# EAGLE design Arduino Neptune (EAGLE 9.4.1)
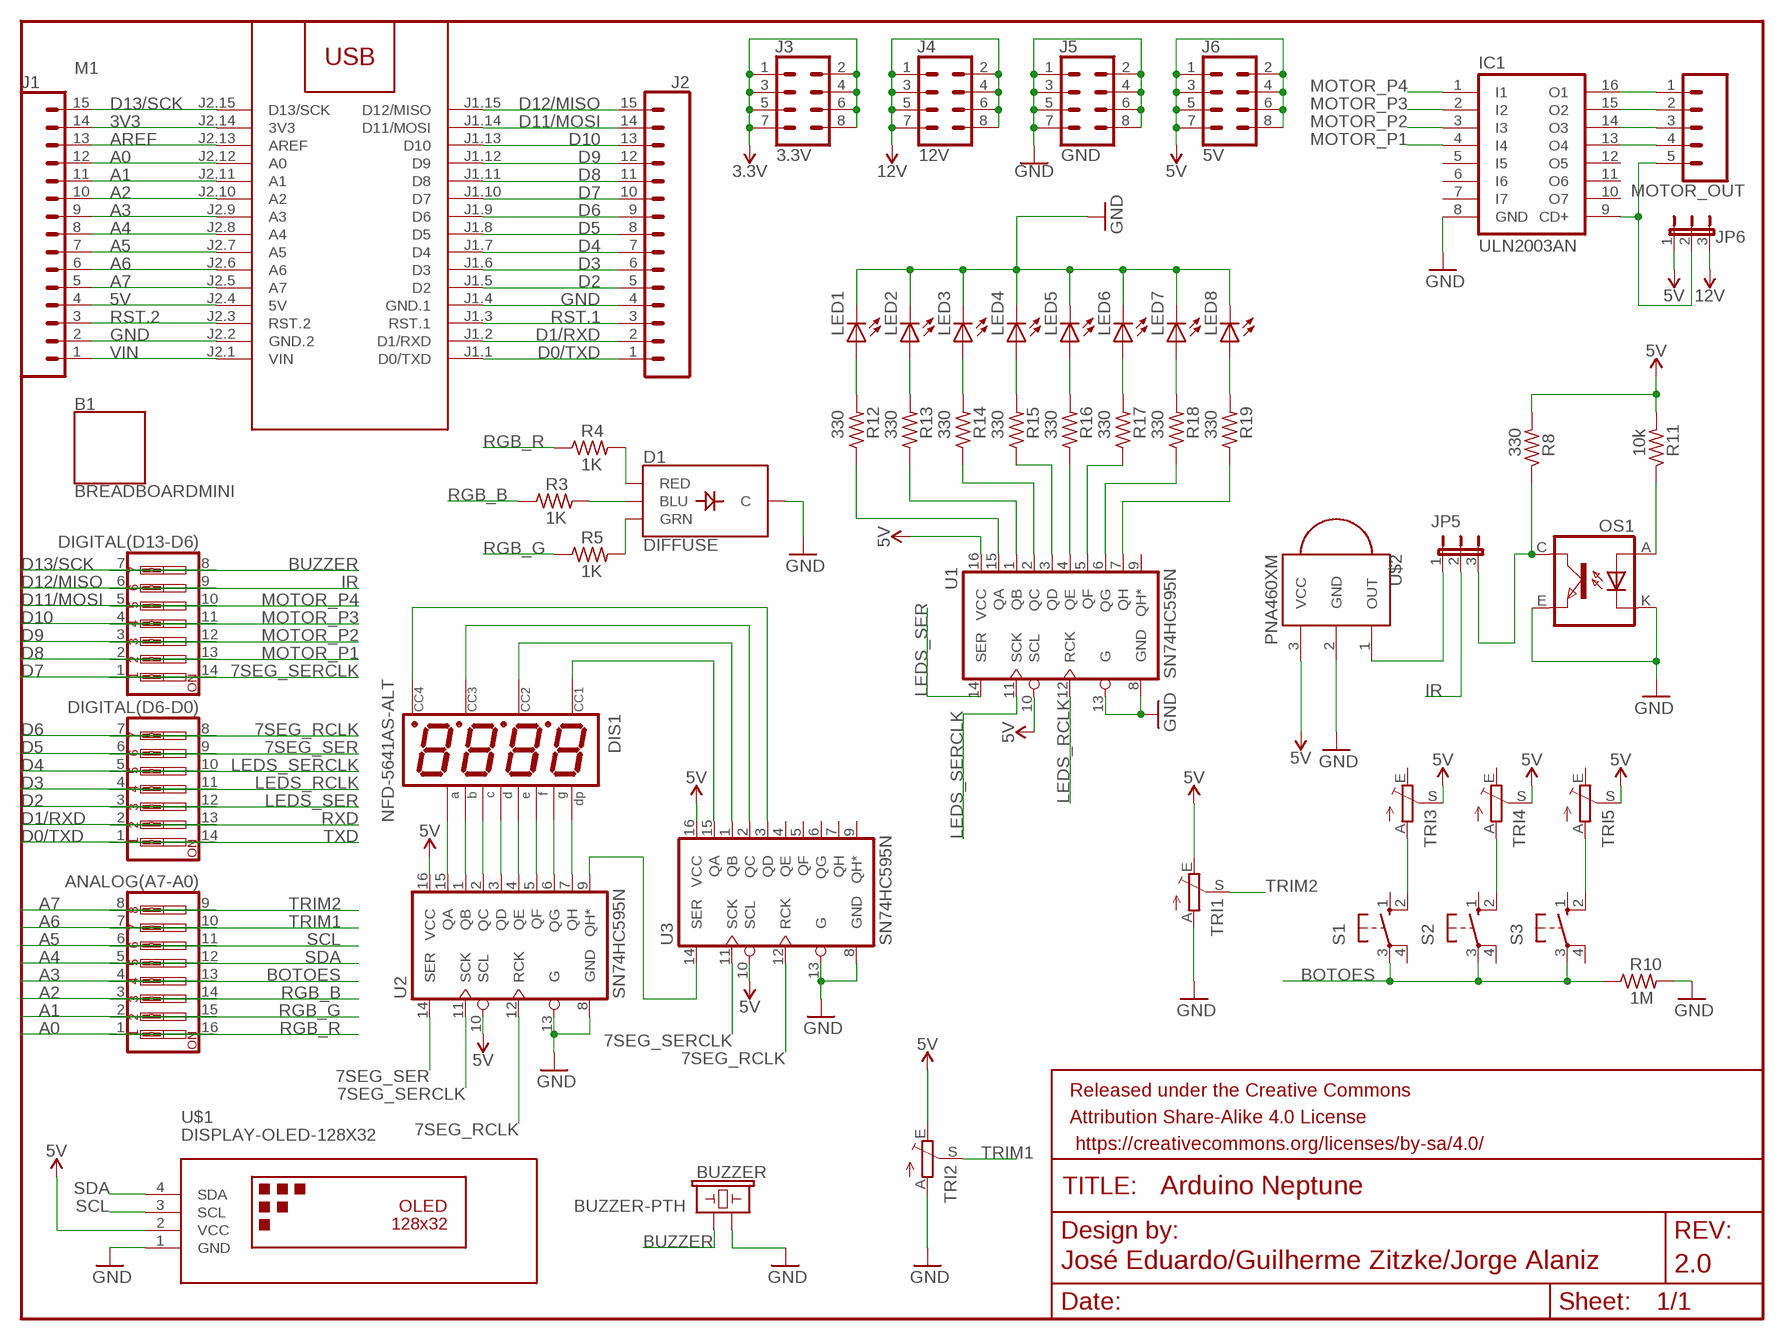
[diagram p0: schematic, sheet 1]

## Parts
ANALOG(A7-A0)  SW_DIP-8  [EDG-08]
B1  BREADBOARDMINI  [BREADBOARD-MINI]
BUZZER  BUZZER-PTH  [BUZZER-12MM]
D1  DIFFUSE  LED-RGB-CCDIFFUSE  [LED-RGB-THRU]
DIGITAL(D6-D0)  SW_DIP-7  [EDG-07]
DIGITAL(D13-D6)  SW_DIP-7  [EDG-07]
DIS1  NFD-5641AS-ALT  [NFD-5641]
FRAME2  FRAME-LETTER  [CREATIVE_COMMONS]
IC1  ULN2003AN  [DIL16]
J1  CONN_15LOCK_LONGPADS  [1X15_LOCK_LONGPADS]
J2  CONN_15LOCK_LONGPADS  [1X15_LOCK_LONGPADS]
J3  3.3V  CONN_04X2  [2X4]
J4  12V  CONN_04X2  [2X4]
J5  GND  CONN_04X2  [2X4]
J6  5V  CONN_04X2  [2X4]
JP5  JP2E  [JP2]
JP6  JP2E  [JP2]
LED1  LED5MM  [LED5MM]
LED2  LED5MM  [LED5MM]
LED3  LED5MM  [LED5MM]
LED4  LED5MM  [LED5MM]
LED5  LED5MM  [LED5MM]
LED6  LED5MM  [LED5MM]
LED7  LED5MM  [LED5MM]
LED8  LED5MM  [LED5MM]
M1  ARDUINO-NANO-3.0  [ARDUINO-NANO-3.0]
MOTOR_OUT  CONN_05JST-VERT  [JST-5-PTH-VERT]
OS1  TCRT5000  [TCRT5000]
R3  1K  R-US_0204/7  [0204/7]
R4  1K  R-US_0204/7  [0204/7]
R5  1K  R-US_0204/7  [0204/7]
R8  330  R-US_0204/7  [0204/7]
R10  1M  R-US_0204/7  [0204/7]
R11  10k  R-US_0204/7  [0204/7]
R12  330  R-US_0204/7  [0204/7]
R13  330  R-US_0204/7  [0204/7]
R14  330  R-US_0204/7  [0204/7]
R15  330  R-US_0204/7  [0204/7]
R16  330  R-US_0204/7  [0204/7]
R17  330  R-US_0204/7  [0204/7]
R18  330  R-US_0204/7  [0204/7]
R19  330  R-US_0204/7  [0204/7]
S1  40-XX  [B3F-40XX]
S2  40-XX  [B3F-40XX]
S3  40-XX  [B3F-40XX]
TRI1  TRIM_EU-B64Y  [B64Y]
TRI2  TRIM_EU-B64Y  [B64Y]
TRI3  TRIM_EU-B64Y  [B64Y]
TRI4  TRIM_EU-B64Y  [B64Y]
TRI5  TRIM_EU-B64Y  [B64Y]
U1  SN74HC595N  74HC595N  [DIP16]
U2  SN74HC595N  74HC595N  [DIP16]
U3  SN74HC595N  74HC595N  [DIP16]
U$1  DISPLAY-OLED-128X32  [DISPLAY-OLED-128X32]
U$2  PNA460XM  [PNA460XM]

## Nets
3.3V: J3.1 J3.2 J3.3 J3.4 J3.5 J3.6 J3.7 J3.8
3V3: J1.14 M1.J2.14(3V3)
5V: J1.4 J6.1 J6.2 J6.3 J6.4 J6.5 J6.6 J6.7 J6.8 JP6.1 M1.J2.4(5V) R8.2 R11.2 TRI1.E TRI2.E TRI3.S TRI4.S TRI5.S U1.10(SCL) U1.16(VCC) U2.10(SCL) U2.16(VCC) U3.10(SCL) U3.16(VCC) U$1.2(VCC) U$2.3(VCC)
7SEG_RCLK: DIGITAL(D6-D0).7 U2.12(RCK) U3.12(RCK)
7SEG_SER: DIGITAL(D6-D0).6 U2.14(SER)
7SEG_SERCLK: DIGITAL(D13-D6).1 U2.11(SCK) U3.11(SCK)
12V: J4.1 J4.2 J4.3 J4.4 J4.5 J4.6 J4.7 J4.8 JP6.3
A0: ANALOG(A7-A0).16 J1.12 M1.J2.12(A0)
A1: ANALOG(A7-A0).15 J1.11 M1.J2.11(A1)
A2: ANALOG(A7-A0).14 J1.10 M1.J2.10(A2)
A3: ANALOG(A7-A0).13 J1.9 M1.J2.9(A3)
A4: ANALOG(A7-A0).12 J1.8 M1.J2.8(A4)
A5: ANALOG(A7-A0).11 J1.7 M1.J2.7(A5)
A6: ANALOG(A7-A0).10 J1.6 M1.J2.6(A6)
A7: ANALOG(A7-A0).9 J1.5 M1.J2.5(A7)
AREF: J1.13 M1.J2.13(AREF)
BOTOES: ANALOG(A7-A0).4 R10.1 S1.3(P) S2.3(P) S3.3(P)
BUZZER: BUZZER.+ DIGITAL(D13-D6).7
D0/TXD: DIGITAL(D6-D0).14 J2.1 M1.J1.1(D0/TXD)
D1/RXD: DIGITAL(D6-D0).13 J2.2 M1.J1.2(D1/RXD)
D2: DIGITAL(D6-D0).12 J2.5 M1.J1.5(D2)
D3: DIGITAL(D6-D0).11 J2.6 M1.J1.6(D3)
D4: DIGITAL(D6-D0).10 J2.7 M1.J1.7(D4)
D5: DIGITAL(D6-D0).9 J2.8 M1.J1.8(D5)
D6: DIGITAL(D6-D0).8 J2.9 M1.J1.9(D6)
D7: DIGITAL(D13-D6).14 J2.10 M1.J1.10(D7)
D8: DIGITAL(D13-D6).13 J2.11 M1.J1.11(D8)
D9: DIGITAL(D13-D6).12 J2.12 M1.J1.12(D9)
D10: DIGITAL(D13-D6).11 J2.13 M1.J1.13(D10)
D11/MOSI: DIGITAL(D13-D6).10 J2.14 M1.J1.14(D11/MOSI)
D12/MISO: DIGITAL(D13-D6).9 J2.15 M1.J1.15(D12/MISO)
D13/SCK: DIGITAL(D13-D6).8 J1.15 M1.J2.15(D13/SCK)
GND: BUZZER.- D1.2(C) IC1.8(GND) J1.2 J2.4 J5.1 J5.2 J5.3 J5.4 J5.5 J5.6 J5.7 J5.8 LED1.K(C) LED2.K(C) LED3.K(C) LED4.K(C) LED5.K(C) LED6.K(C) LED7.K(C) LED8.K(C) M1.J1.4(GND.1) M1.J2.2(GND.2) OS1.E(EMITTER) OS1.K(CATHODE) R10.2 TRI1.A TRI2.A U1.8(GND) U1.13(G) U2.8(GND) U2.13(G) U3.8(GND) U3.13(G) U$1.1(GND) U$2.2(GND)
IR: DIGITAL(D13-D6).6 JP5.2
LEDS_RCLK: DIGITAL(D6-D0).4 U1.12(RCK)
LEDS_SER: DIGITAL(D6-D0).3 U1.14(SER)
LEDS_SERCLK: DIGITAL(D6-D0).5 U1.11(SCK)
MOTOR_P1: DIGITAL(D13-D6).2 IC1.4(I4)
MOTOR_P2: DIGITAL(D13-D6).3 IC1.3(I3)
MOTOR_P3: DIGITAL(D13-D6).4 IC1.2(I2)
MOTOR_P4: DIGITAL(D13-D6).5 IC1.1(I1)
N$1: D1.3(GRN) R5.2
N$2: D1.4(BLU) R3.2
N$3: D1.1(RED) R4.2
N$4: IC1.16(O1) MOTOR_OUT.1
N$5: IC1.9(CD+) JP6.2 MOTOR_OUT.5
N$6: LED8.A R19.2
N$7: LED7.A R18.2
N$8: LED6.A R17.2
N$9: R16.1 U1.4(QE)
N$10: LED5.A R16.2
N$11: LED4.A R15.2
N$12: LED3.A R14.2
N$13: LED2.A R13.2
N$14: LED1.A R12.2
N$15: JP5.1 U$2.1(OUT)
N$17: OS1.A(ANODE) R11.1
N$18: JP5.3 OS1.C(COLLECTOR) R8.1
N$66: IC1.15(O2) MOTOR_OUT.2
N$67: IC1.14(O3) MOTOR_OUT.3
N$68: IC1.13(O4) MOTOR_OUT.4
N$70: DIS1.P$11 U2.15(QA)
N$71: DIS1.P$7 U2.1(QB)
N$72: DIS1.P$4 U2.2(QC)
N$73: DIS1.P$2 U2.3(QD)
N$74: DIS1.P$1 U2.4(QE)
N$75: DIS1.P$10 U2.5(QF)
N$76: DIS1.P$5 U2.6(QG)
N$77: DIS1.P$3 U2.7(QH)
N$78: U2.9(QH*) U3.14(SER)
N$79: DIS1.P$8 U3.2(QC)
N$80: DIS1.P$9 U3.1(QB)
N$81: DIS1.P$12 U3.15(QA)
N$82: DIS1.P$6 U3.3(QD)
N$92: R12.1 U1.15(QA)
N$93: R13.1 U1.1(QB)
N$94: R14.1 U1.2(QC)
N$95: R15.1 U1.3(QD)
N$97: R17.1 U1.5(QF)
N$98: R18.1 U1.6(QG)
N$99: S1.2(S1) TRI3.A
N$102: R19.1 U1.7(QH)
N$103: S2.2(S1) TRI4.A
N$104: S3.2(S1) TRI5.A
RGB_B: ANALOG(A7-A0).3 R3.1
RGB_G: ANALOG(A7-A0).2 R5.1
RGB_R: ANALOG(A7-A0).1 R4.1
RST.1: J2.3 M1.J1.3(RST.1)
RST.2: J1.3 M1.J2.3(RST.2)
RXD: DIGITAL(D6-D0).2
SCL: ANALOG(A7-A0).6 U$1.3(SCL)
SDA: ANALOG(A7-A0).5 U$1.4(SDA)
TRIM1: ANALOG(A7-A0).7 TRI2.S
TRIM2: ANALOG(A7-A0).8 TRI1.S
TXD: DIGITAL(D6-D0).1
VIN: J1.1 M1.J2.1(VIN)
Unconnected: IC1.5(I5) IC1.6(I6) IC1.7(I7) IC1.10(O7) IC1.11(O6) IC1.12(O5) S1.1(S) S1.4(P1) S2.1(S) S2.4(P1) S3.1(S) S3.4(P1) TRI3.E TRI4.E TRI5.E U1.9(QH*) U3.4(QE) U3.5(QF) U3.6(QG) U3.7(QH) U3.9(QH*)

## Library data of the parts
ANALOG(A7-A0) = special:SW_DIP-8: DIP SWITCH
B1 = SparkFun-Boards:BREADBOARD: SparkFun Breadboard Mini This is the mechnical outline for the very small self adhesive breadboard from SparkFun Electronics and our prototyping breadboard of the same size. Good for very small proto areas. SparkFun Products: White <https://www.sparkfun.com/products/7916> Green <https://www.sparkfun.com/products/12046> Black <https://www.sparkfun.com/products/12047> Red <https://www.sparkfun.com/products/12044> Blue <https://www.sparkfun.com/products/12045> SparkFun Solder-able Breadboard-Mini <https://www.sparkfun.com/products/12702>; PROD_ID: COMP-12034
BUZZER = SparkFun-Electromechanical:BUZZER: Buzzer Small round buzzers that operate around the audible 2kHz range. You can use these as speakers to create simple music or user interfaces. Variant Overview: PTH - Mini Speaker - PC Mount 12mm 2.048kHz <https://www.sparkfun.com/products/7950> PTH_KIT - Mini Speaker - PC Mount 12mm 2.048kHz <https://www.sparkfun.com/products/7950> KIT simplifies soldering by adding stop mask to one side of the pads. PTH_NO_SILK - Mini Speaker - PC Mount 12mm 2.048kHz <https://www.sparkfun.com/products/7950> No silkscreen indicator of buzzer outline. PTH_KIT_NO_SILK - Mini Speaker - PC Mount 12mm 2.048kHz <https://www.sparkfun.com/products/7950> KIT package w/o silkscreen SMD - Buzzer Audio Magnetic (CCV-084B16) SMD buzzer used on, e.g. the LilyPad Buzzer <https://www.sparkfun.com/products/8463> and RFID USB Reader <https://www.sparkfun.com/products/9963>. SMD_KIT - Buzzer Audio Magnetic (CCV-084B16) SMD Buzzer with elongated pins to make soldering easier. Used on the SparkFun Simon Says - Surface Mount Soldering Kit <https://www.sparkfun.com/products/10935>.; PROD_ID: COMP-08253; SF_SKU: COM-07950
D1 = SparkFun-LED:LED-RGB-CC: LED-RGB Common Cathode Packages: LED RGB-THRU LED_PIRANHA_5MM SparkFun Products: RGB Diffused Common Cathode- Diffuse <[https://www.sparkfun.com/products/9264]> RGB Diffused Common Cathode - Clear <[https://www.sparkfun.com/products/105]> LED-RGB 5mm Square (Piranha) <[https://www.sparkfun.com/products/11679]>; PROD_ID: DIO-09434
DIGITAL(D6-D0) DIGITAL(D13-D6) = special:SW_DIP-7: DIP SWITCH
DIS1 = display-nfd:NFD-5641AS-ALT: Four Digit 0.56" CC Seven-Segment LED Display Futurlec part number: 7FR5641AS Created by RobG
FRAME2 = SparkFun-Aesthetics:FRAME-LETTER: Schematic Frame - Letter Standard 8.5x11 US Letter frame; DESIGNER: José Eduardo/Guilherme Zitzke/Jorge Alaniz; REV: 2.0
IC1 = uln-udn:ULN2003A: DRIVER ARRAY
J1 J2 = SparkFun-Connectors:CONN_15: Multi connection point. Often used as Generic Header-pin footprint for 0.1 inch spaced/style header connections On any of the 0.1 inch spaced packages, you can populate with these: Break Away Headers - Straight <https://www.sparkfun.com/products/116> (PRT-00116) Break Away Male Headers - Right Angle <https://www.sparkfun.com/products/553> (PRT-00553) Female Headers <https://www.sparkfun.com/products/115> (PRT-00115) Break Away Headers - Machine Pin <https://www.sparkfun.com/products/117> (PRT-00117) Break Away Female Headers - Swiss Machine Pin <https://www.sparkfun.com/products/743> (PRT-00743) For SCREWTERMINALS and SPRING TERMINALS visit here: Screw Terimnals on SparkFun.com <https://www.sparkfun.com/search/results?term=Screw+Terminals> (5mm/3.5mm/2.54mm spacing) This device is also useful as a general connection point to wire up your design to another part of your project. Our various solder wires solder well into these plated through hole pads. Hook-Up Wire - Assortment (Stranded, 22 AWG) <https://www.sparkfun.com/products/11375> (PRT-11375) Hook-Up Wire - Assortment (Solid Core, 22 AWG) <https://www.sparkfun.com/products/11367> (PRT-11367) View the entire wire category on our website here <https://www.sparkfun.com/categories/141> Special notes: Molex polarized connector foot print use with SKU : PRT-08231 with associated crimp pins and housings. 1MM SMD Version SKU: PRT-10208 NOTES ON THE VARIANTS LOCK and LOCK_LONGPADS... This footprint was designed to help hold the alignment of a through-hole component (i.e. 6-pin header) while soldering it into place. You may notice that each hole has been shifted either up or down by 0.005 of an inch from it's more standard position (which is a perfectly straight line). This slight alteration caused the pins (the squares in the middle) to touch the edges of the holes. Because they are alternating, it causes a "brace" to hold the component in place. 0.005 has proven to be the perfect amount of "off-center" position when using our standard breakaway headers. Although looks a little odd when you look at the bare footprint, once you have a header in there, the alteration is very hard to notice. Also,if you push a header all the way into place, it is covered up entirely on the bottom side.
J3-J6 = SparkFun-Connectors:CONN_04X2: Multi connection point. Often used as Generic Header-pin footprint for 0.1 inch spaced/style header connections On any of the 0.1 inch spaced packages, you can populate with these: Break Away Headers - Straight <https://www.sparkfun.com/products/116> (PRT-00116) Break Away Male Headers - Right Angle <https://www.sparkfun.com/products/553> (PRT-00553) Female Headers <https://www.sparkfun.com/products/115> (PRT-00115) Break Away Headers - Machine Pin <https://www.sparkfun.com/products/117> (PRT-00117) Break Away Female Headers - Swiss Machine Pin <https://www.sparkfun.com/products/743> (PRT-00743)
JP5 JP6 = jumper:JP2E: JUMPER
LED1-LED8 = adafruit:LED: LED OSRAM: - CHIPLED LG R971, LG N971, LY N971, LG Q971, LY Q971, LO R971, LY R971 LH N974, LH R974 LS Q976, LO Q976, LY Q976 LO Q996 - Hyper CHIPLED LW Q18S LB Q993, LB Q99A, LB R99A - SideLED LS A670, LO A670, LY A670, LG A670, LP A670 LB A673, LV A673, LT A673, LW A673 LH A674 LY A675 LS A676, LA A676, LO A676, LY A676, LW A676 LS A679, LY A679, LG A679 - Hyper Micro SIDELED® LS Y876, LA Y876, LO Y876, LY Y876 LT Y87S - SmartLED LW L88C, LW L88S LB L89C, LB L89S, LG L890 LS L89K, LO L89K, LY L89K LS L896, LA L896, LO L896, LY L896 - TOPLED LS T670, LO T670, LY T670, LG T670, LP T670 LSG T670, LSP T670, LSY T670, LOP T670, LYG T670 LG T671, LOG T671, LSG T671 LB T673, LV T673, LT T673, LW T673 LH T674 LS T676, LA T676, LO T676, LY T676, LB T676, LH T676, LSB T676, LW T676 LB T67C, LV T67C, LT T67C, LS T67K, LO T67K, LY T67K, LW E67C LS E67B, LA E67B, LO E67B, LY E67B, LB E67C, LV E67C, LT E67C LW T67C LS T679, LY T679, LG T679 LS T770, LO T770, LY T770, LG T770, LP T770 LB T773, LV T773, LT T773, LW T773 LH T774 LS E675, LA E675, LY E675, LS T675 LS T776, LA T776, LO T776, LY T776, LB T776 LHGB T686 LT T68C, LB T68C - Hyper Mini TOPLED® LB M676 - Mini TOPLED Santana® LG M470 LS M47K, LO M47K, LY M47K Source: http://www.osram.convergy.de/
M1 = diy-modules:ARDUINO-NANO-3.0: Arduino Nano 3.0
MOTOR_OUT = SparkFun-Connectors:CONN_05: Multi connection point. Often used as Generic Header-pin footprint for 0.1 inch spaced/style header connections On any of the 0.1 inch spaced packages, you can populate with these: Break Away Headers - Straight <https://www.sparkfun.com/products/116> (PRT-00116) Break Away Male Headers - Right Angle <https://www.sparkfun.com/products/553> (PRT-00553) Female Headers <https://www.sparkfun.com/products/115> (PRT-00115) Break Away Headers - Machine Pin <https://www.sparkfun.com/products/117> (PRT-00117) Break Away Female Headers - Swiss Machine Pin <https://www.sparkfun.com/products/743> (PRT-00743) For SCREWTERMINALS and SPRING TERMINALS visit here: Screw Terimnals on SparkFun.com <https://www.sparkfun.com/search/results?term=Screw+Terminals> (5mm/3.5mm/2.54mm spacing) This device is also useful as a general connection point to wire up your design to another part of your project. Our various solder wires solder well into these plated through hole pads. Hook-Up Wire - Assortment (Stranded, 22 AWG) <https://www.sparkfun.com/products/11375> (PRT-11375) Hook-Up Wire - Assortment (Solid Core, 22 AWG) <https://www.sparkfun.com/products/11367> (PRT-11367) View the entire wire category on our website here <https://www.sparkfun.com/categories/141> Special notes: Molex polarized connector foot print use with SKU : PRT-08231 with associated crimp pins and housings. 1MM SMD Version SKU: PRT-10208
OS1 = tcrt5000:TCRT5000
R3-R5 R8 R10-R19 = adafruit:R-US_: RESISTOR, American symbol
S1-S3 = switch-omron:40-XX: OMRON SWITCH; MF: OMRON COMPONENTS USA; MPN: B3F-4000; OC_FARNELL: 176434; OC_NEWARK: 36K3105
TRI1-TRI5 = pot:TRIM_EU-: POTENTIOMETER
U1-U3 = SparkFun-IC-Logic:74*595: 8-Bit Shift Register (Serial to Parallel) Datasheet <http://cdn.sparkfun.com/datasheets/BreakoutBoards/MM74HC595.pdf> SparkFun Products SparkFun Shift Register Breakout - 74HC595 <https://www.sparkfun.com/products/10680> (BOB-10680); PROD_ID: IC-13123
U$1 = diy-modules (2):DISPLAY-OLED-128X32: 128x32 Dot Matrix OLED Module with I2C interface based on SSD1306 chip More details available here: http://www.tinyosshop.com/index.php?route=product/product&product_id=953 Schematic available here: http://www.tinyosshop.com/datasheet/OLED%2012832.pdf SSD1306 datasheet: https://cdn-shop.adafruit.com/datasheets/SSD1306.pdf Click here to find device on ebay.com <http://www.ebay.com/sch/oled+display+128x32+i2c>
U$2 = adafruit:PNA460XM: IR 38KHz receiver PNA4602 and related receivers http://www.ladyada.net/library/pcb/eaglelibrary.html

## Net classes
0 default: width 0.305 mm, drill 0.35 mm, clearance 0.305 mm

## Board
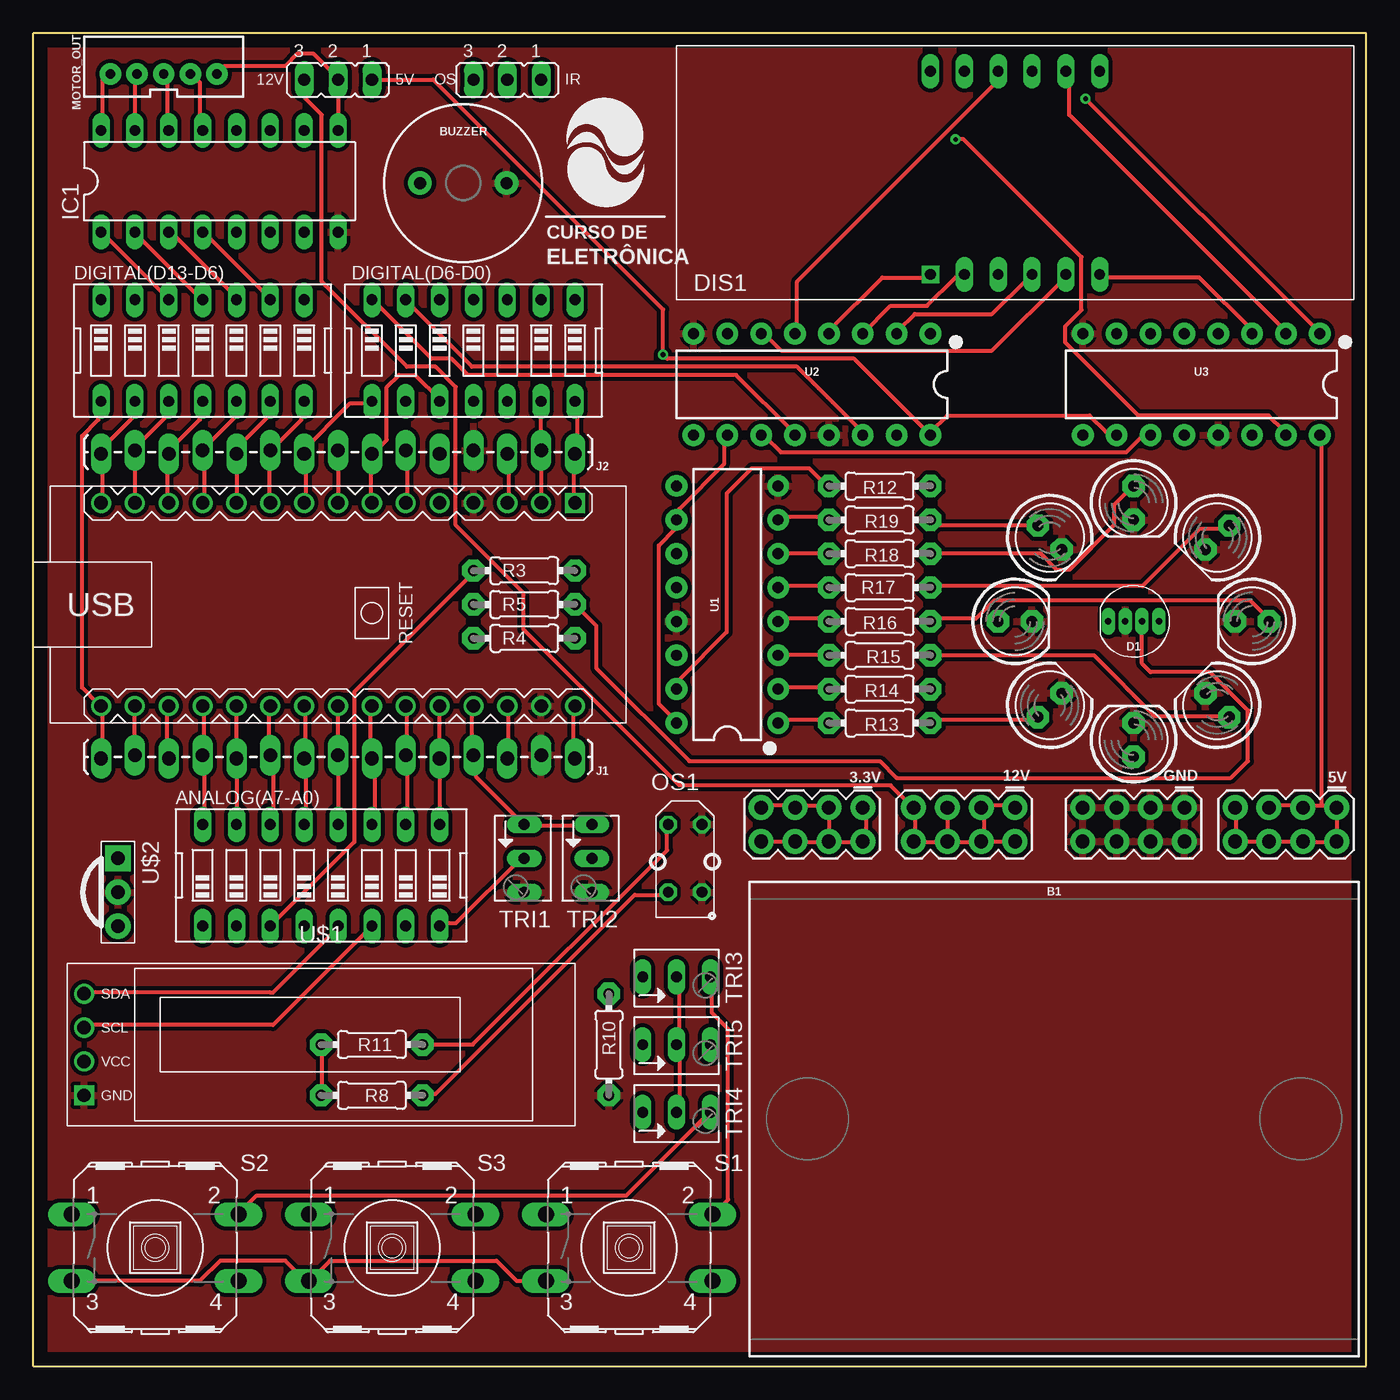
[diagram p1: board, top side]
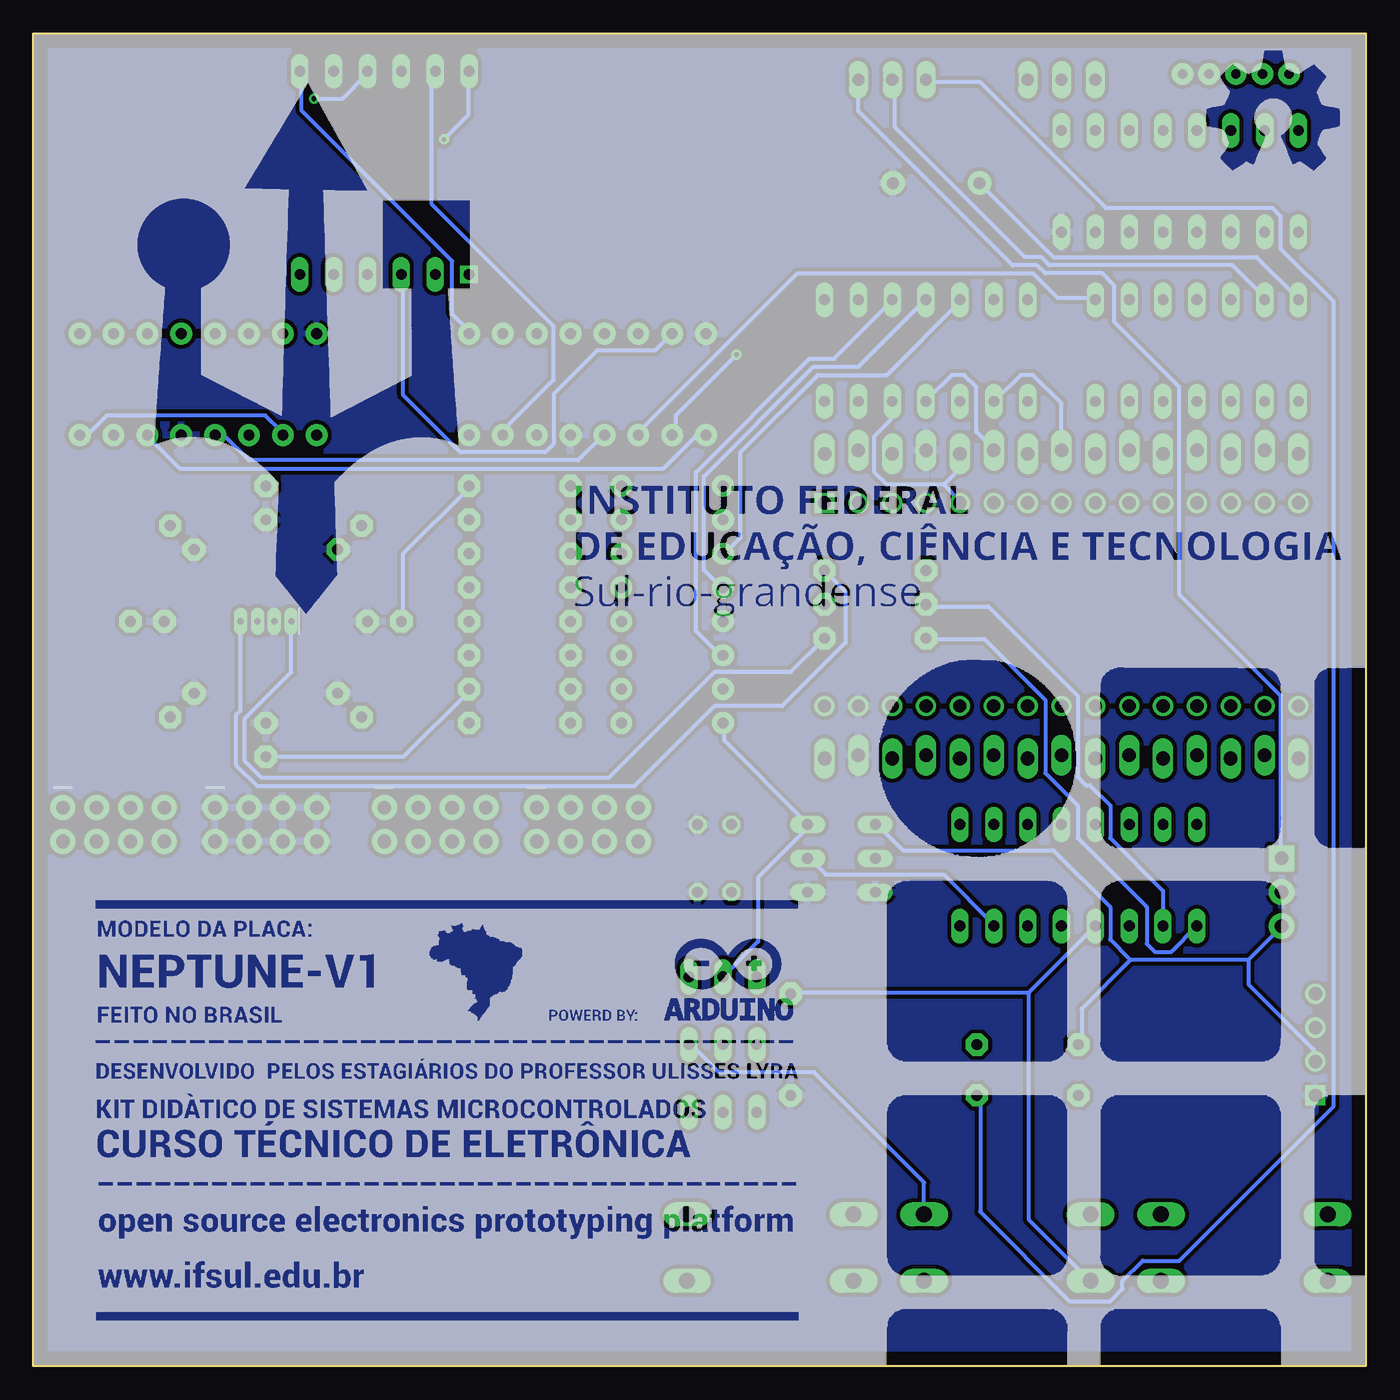
[diagram p2: board, bottom side, seen from below]

Size 100 x 100 mm. Coordinates in mm from the lower left corner, seen from the top.
Outline: 0,0 0,100 100,100 100,0 0,0
Copper layers (1*16): Top 0.035mm / dielectric 1.5mm / Bottom 0.035mm
Design rules "default *": minimum track width 6mil, minimum drill 0.35mm, track to track 12mil, track to pad 6mil, pad to pad 6mil, via to via 6mil, smd to smd 6mil, copper to edge 40mil, drill to drill 6mil, minimum pad ring 10mil, minimum via ring 8mil, stop-mask expansion 4mil, vias tented up to drill 0mil, thermal gap 10mil

### Footprints (pad centres in the part's own frame; a part is rotated, then mirrored left to right if it is on the bottom)
EDG-08 = drill 0.813 long: 1 -8.89,-3.81; 2 -6.35,-3.81; 3 -3.81,-3.81; 4 -1.27,-3.81; 5 1.27,-3.81; 6 3.81,-3.81; 7 6.35,-3.81; 8 8.89,-3.81; 9 8.89,3.81; 10 6.35,3.81; 11 3.81,3.81; 12 1.27,3.81; 13 -1.27,3.81; 14 -3.81,3.81; 15 -6.35,3.81; 16 -8.89,3.81
BUZZER-12MM = drill 0.9 pad 1.778: + 3.25,0; - -3.25,0
LED-RGB-THRU = drill 0.5 long: 1 1.905,0; 2 0.635,0; 3 -0.635,0; 4 -1.905,0
EDG-07 = drill 0.813 long: 1 -7.62,-3.81; 2 -5.08,-3.81; 3 -2.54,-3.81; 4 0,-3.81; 5 2.54,-3.81; 6 5.08,-3.81; 7 7.62,-3.81; 8 7.62,3.81; 9 5.08,3.81; 10 2.54,3.81; 11 0,3.81; 12 -2.54,3.81; 13 -5.08,3.81; 14 -7.62,3.81
NFD-5641 = drill 0.8 square: P$1 -6.35,-7.62 | drill 0.8 long: P$2 -3.81,-7.62; P$3 -1.27,-7.62; P$4 1.27,-7.62; P$5 3.81,-7.62; P$6 6.35,-7.62; P$7 6.35,7.62; P$8 3.81,7.62; P$9 1.27,7.62; P$10 -1.27,7.62; P$11 -3.81,7.62; P$12 -6.35,7.62
DIL16 = drill 0.813 long: 1 -8.89,-3.81; 2 -6.35,-3.81; 3 -3.81,-3.81; 4 -1.27,-3.81; 5 1.27,-3.81; 6 3.81,-3.81; 7 6.35,-3.81; 8 8.89,-3.81; 9 8.89,3.81; 10 6.35,3.81; 11 3.81,3.81; 12 1.27,3.81; 13 -1.27,3.81; 14 -3.81,3.81; 15 -6.35,3.81; 16 -8.89,3.81
1X15_LOCK_LONGPADS = drill 1.016 long: 1 0,0.127; 2 2.54,-0.127; 3 5.08,0.127; 4 7.62,-0.127; 5 10.16,0.127; 6 12.7,-0.127; 7 15.24,0.127; 8 17.78,-0.127; 9 20.32,0.127; 10 22.86,-0.127; 11 25.4,0.127; 12 27.94,-0.127; 13 30.48,0.127; 14 33.02,-0.127; 15 35.56,0.127
2X4 = drill 1.016 pad 1.88: 1 -3.81,-1.27; 2 -3.81,1.27; 3 -1.27,-1.27; 4 -1.27,1.27; 5 1.27,-1.27; 6 1.27,1.27; 7 3.81,-1.27; 8 3.81,1.27
JP2 = drill 0.914 long: 1 -2.54,0; 2 0,0; 3 2.54,0
LED5MM = drill 0.813 pad 1.676 octagon: A -1.27,0; K 1.27,0
ARDUINO-NANO-3.0 = drill 1 square: J1.1 17.78,7.62 | drill 1: J1.2 15.24,7.62; J1.3 12.7,7.62; J1.4 10.16,7.62; J1.5 7.62,7.62; J1.6 5.08,7.62; J1.7 2.54,7.62; J1.8 0,7.62; J1.9 -2.54,7.62; J1.10 -5.08,7.62; J1.11 -7.62,7.62; J1.12 -10.16,7.62; J1.13 -12.7,7.62; J1.14 -15.24,7.62; J1.15 -17.78,7.62; J2.1 17.78,-7.62; J2.2 15.24,-7.62; J2.3 12.7,-7.62; J2.4 10.16,-7.62; J2.5 7.62,-7.62; J2.6 5.08,-7.62; J2.7 2.54,-7.62; J2.8 0,-7.62; J2.9 -2.54,-7.62; J2.10 -5.08,-7.62; J2.11 -7.62,-7.62; J2.12 -10.16,-7.62; J2.13 -12.7,-7.62; J2.14 -15.24,-7.62; J2.15 -17.78,-7.62
JST-5-PTH-VERT = drill 0.7 pad 1.6: 1 -4,0.18; 2 -2,0.18; 3 0,0.18; 4 2,0.18; 5 4,0.18
TCRT5000 = drill 0.8 octagon: A -2.54,-1.27; C 2.54,-1.27; E 2.54,1.27; K -2.54,1.27
0204/7 = drill 0.813 pad 1.676 octagon: 1 -3.81,0; 2 3.81,0
B3F-40XX = drill 1.194 long: 1 -6.248,2.489; 2 6.248,2.489; 3 -6.248,-2.489; 4 6.248,-2.489
B64Y = drill 0.813 long: A 2.54,0; E -2.54,0; S 0,0
DIP16 = drill 0.813 pad 1.626: 1 -8.89,-3.81; 2 -6.35,-3.81; 3 -3.81,-3.81; 4 -1.27,-3.81; 5 1.27,-3.81; 6 3.81,-3.81; 7 6.35,-3.81; 8 8.89,-3.81; 9 8.89,3.81; 10 6.35,3.81; 11 3.81,3.81; 12 1.27,3.81; 13 -1.27,3.81; 14 -3.81,3.81; 15 -6.35,3.81; 16 -8.89,3.81
DISPLAY-OLED-128X32 = drill 1 square: 1 -17.78,-3.81 | drill 1: 2 -17.78,-1.27; 3 -17.78,1.27; 4 -17.78,3.81
PNA460XM = drill 1.016 pad 1.93 square: 1 -2.54,0 | drill 1.016 pad 1.93: 2 0,0; 3 2.54,0

### Placement (x,y rotation side)
ANALOG(A7-A0)  21.59,36.83 0 top
B1  76.58,18.54 0 top
BUZZER  32.26,88.77 180 top
D1  82.55,55.88 180 top
DIGITAL(D6-D0)  33.02,76.2 180 top
DIGITAL(D13-D6)  12.7,76.2 180 top
DIS1  73.66,89.53 0 top
FRAME2  22.96,-11.4 0 top  (outside the outline)
IC1  13.97,88.9 0 top
J1  40.64,45.72 180 top
J2  40.64,68.58 180 top
J3  58.42,40.64 180 top
J4  69.85,40.64 180 top
J5  82.55,40.64 180 top
J6  93.98,40.64 180 top
JP5  35.56,96.52 180 top
JP6  22.86,96.52 180 top
LED1  73.66,55.88 0 top
LED2  76.26,49.59 45 top
LED3  82.55,46.99 90 top
LED4  88.84,49.59 135 top
LED5  91.44,55.88 180 top
LED6  88.84,62.17 225 top
LED7  82.55,64.77 270 top
LED8  76.26,62.17 315 top
M1  22.86,57.15 0 top
MOTOR_OUT  9.78,96.77 0 top
OS1  48.9,38.1 270 top
R3  36.83,59.69 0 top
R4  36.83,54.61 0 top
R5  36.83,57.15 0 top
R8  25.4,20.32 180 top
R10  43.18,24.13 270 top
R11  25.4,24.13 180 top
R12  63.5,66.04 0 top
R13  63.5,48.26 0 top
R14  63.5,50.8 0 top
R15  63.5,53.34 0 top
R16  63.5,55.88 0 top
R17  63.5,58.42 0 top
R18  63.5,60.96 0 top
R19  63.5,63.5 0 top
S1  44.7,8.89 0 top
S2  9.14,8.89 0 top
S3  26.92,8.89 0 top
TRI1  36.83,38.1 270 top
TRI2  41.91,38.1 270 top
TRI3  48.26,29.21 0 top
TRI4  48.26,19.05 0 top
TRI5  48.26,24.13 0 top
U1  52.07,57.15 90 top
U2  58.42,73.66 180 top
U3  87.63,73.66 180 top
U$1  21.59,24.13 0 top
U$2  6.35,35.56 270 top

### Tracks (layer width: path | path; a pad name or v marks a point on that pad's centre or on a via)
3.3V
  Top 0.305: J3.7 54.86,42.06 57,42.06 J3.5 57.3,42.06 59.44,42.06 J3.3 59.74,41.76 59.74,39.62 J3.4 | J3.1 62.48,41.76 62.48,39.62 J3.2 62.18,39.32 59.74,39.32 J3.4 | J3.8 54.86,39.32 57,39.32 J3.6 57.3,39.32 59.44,39.32 J3.4
3V3
  Top 0.305: J1.14 M1.J2.14
5V  (via drill 0.35)
  Top 0.305: U2.10 51.82,69.8 51.82,67.67 48.46,64.31 48.46,63.7 U1.10 48.16,63.4 48.16,62.79 46.94,61.57 46.94,49.68 48.16,48.46 U1.16 | TRI4.S 48.46,19.2 48.46,24.08 TRI5.S 48.46,24.38 48.46,28.96 TRI3.S | M1.J2.4 32.92,49.38 32.92,46.02 J1.4 33.22,45.72 33.22,44.2 36.58,40.84 TRI1.E 36.88,40.54 41.76,40.54 TRI2.E | J6.5 92.96,42.06 95.1,42.06 J6.3 95.4,42.06 96.62,42.06 | 96.62,42.06 97.54,42.06 J6.1 97.84,41.76 97.84,39.62 J6.2 97.54,39.32 95.4,39.32 J6.4 95.1,39.32 93.27,39.32 | J6.7 90.22,41.76 90.22,39.62 J6.8 90.22,39.32 92.66,39.32 J6.6 | 93.27,39.32 92.96,39.32 J6.6 | 93.27,39.32 J6.6 | JP6.1 30,96.52 47.24,79.27 v47.24,75.89 47.55,75.59 61.57,75.59 U2.16 67.36,70.1 68.58,71.32 79.25,71.32 80.47,70.1 81.08,70.1 U3.10 | 96.62,42.06 96.62,69.8 U3.16 | R8.2 21.64,20.42 21.64,24.13 R11.2
  Bottom 0.305: U1.16 48.16,48.16 48.16,46.94 42.06,40.84 TRI2.E 41.76,40.54 45.62,36.68 45.62,31.85 TRI3.S | 17.68,30.48 19.2,32 19.2,34.44 23.47,38.71 34.75,38.71 36.58,40.54 TRI1.E | U3.16 96.32,70.1 95.71,70.1 94.49,71.32 82.6,71.32 81.38,70.1 U3.10 | v47.24,75.89 51.82,71.32 51.82,70.1 U2.10 | 8.84,30.48 17.68,30.48 | 8.84,30.48 8.84,28.65 3.96,23.77 3.96,22.86 U$1.2 | 8.84,30.48 6.4,32.92 U$2.3 | 17.68,30.48 21.34,26.82 21.34,24.13 R11.2
7SEG_RCLK
  Top 0.305: DIGITAL(D6-D0).7 25.6,79.86 29.87,75.59 31.39,75.59 32.61,74.37 52.73,74.37 57,70.1 U2.12
  Bottom 0.305: U3.12 86.26,69.8 85.65,69.8 83.82,67.97 59.13,67.97 57.3,69.8 U2.12
7SEG_SER
  Top 0.305: DIGITAL(D6-D0).6 28.04,79.86 32.92,74.98 57.3,74.98 62.18,70.1 U2.14
7SEG_SERCLK
  Top 0.305: U3.11 83.82,69.8 83.21,69.8 81.99,68.58 56.08,68.58 54.86,69.8 U2.11
  Bottom 0.305: DIGITAL(D13-D6).1 20.42,80.16 23.16,80.16 24.99,81.99 42.67,81.99 54.56,70.1 U2.11
12V
  Top 0.305: J4.4 71.32,39.32 73.46,39.32 J4.2 | J4.1 73.46,42.06 71.32,42.06 J4.3 71.32,41.76 71.32,39.62 J4.4 | J4.5 J4.6 68.58,39.32 | 68.58,39.32 71.02,39.32 J4.4 | 54.25,43.59 | 54.25,43.59 48.46,43.59 36.78,55.27 36.78,58.01 31.7,63.09 31.7,73.46 30.18,74.98 28.04,74.98 21.64,81.38 21.64,93.88 20.42,95.1 20.42,96.32 JP6.3 | 54.25,43.59 64.31,43.59 65.84,42.06 J4.7 66.14,41.76 66.14,39.62 J4.8 66.14,39.32 68.58,39.32
A0
  Top 0.305: ANALOG(A7-A0).16 12.8,40.84 12.8,45.72 J1.12 12.8,46.02 12.8,49.38 M1.J2.12
A1
  Top 0.305: ANALOG(A7-A0).15 J1.11 M1.J2.11
A2
  Top 0.305: ANALOG(A7-A0).14 17.98,40.84 17.98,45.72 J1.10 17.68,46.02 17.68,49.38 M1.J2.10
A3
  Top 0.305: ANALOG(A7-A0).13 20.42,40.84 20.42,45.41 J1.9 20.42,45.72 20.42,49.38 M1.J2.9
A4
  Top 0.305: ANALOG(A7-A0).12 J1.8 M1.J2.8
A5
  Top 0.305: ANALOG(A7-A0).11 25.6,40.84 25.6,45.41 J1.7 25.3,45.72 25.3,49.38 M1.J2.7
A6
  Top 0.305: ANALOG(A7-A0).10 28.04,40.84 28.04,45.72 J1.6 28.04,46.02 28.04,49.38 M1.J2.6
A7
  Top 0.305: ANALOG(A7-A0).9 J1.5 M1.J2.5
AREF
  Top 0.305: M1.J2.13 10.06,49.38 10.06,45.72 J1.13
BOTOES
  Top 0.305: S2.3 12.5,6.4 14.02,7.92 18.9,7.92 20.42,6.4 S3.3 20.73,6.4 22.25,7.92 34.75,7.92 36.27,6.4 S1.3
  Bottom 0.305: 25.3,28.04 43,28.04 R10.1 | 25.3,28.04 25.3,10.97 20.73,6.4 S3.3 | ANALOG(A7-A0).4 25.3,28.04
BUZZER
  Bottom 0.305: DIGITAL(D13-D6).7 5.18,80.16 8.23,83.21 23.47,83.21 29.01,88.75 BUZZER.+
D0/TXD
  Top 0.305: DIGITAL(D6-D0).14 40.84,72.24 40.84,68.58 J2.1 40.54,68.28 40.54,64.92 M1.J1.1
D1/RXD
  Top 0.305: DIGITAL(D6-D0).13 J2.2 M1.J1.2
D2
  Bottom 0.305: 31.7,66.14 35.97,66.14 36.88,67.06 36.88,69.8 35.66,71.02 35.66,72.24 DIGITAL(D6-D0).12 | 31.7,66.14 30.48,64.92 M1.J1.5 | J2.5 30.48,67.36 31.7,66.14
D3
  Top 0.305: M1.J1.6 28.04,64.92 28.04,68.58 J2.6
  Bottom 0.305: DIGITAL(D6-D0).11 32.92,72.54 31.09,74.37 30.18,74.37 29.26,73.46 29.26,70.1 28.04,68.89 J2.6
D4
  Top 0.305: DIGITAL(D6-D0).10 30.48,72.54 28.65,74.37 27.43,74.37 26.52,73.46 26.52,69.49 25.6,68.58 J2.7 25.3,68.28 25.3,64.92 M1.J1.7
D5
  Top 0.305: J2.8 M1.J1.8
  Bottom 0.305: J2.8 22.86,72.24 24.99,74.37 25.91,74.37 27.74,72.54 DIGITAL(D6-D0).9
D6
  Top 0.305: DIGITAL(D6-D0).8 25.3,72.24 23.77,72.24 20.12,68.58 J2.9 20.42,68.28 20.42,64.92 M1.J1.9
D7
  Top 0.305: DIGITAL(D13-D6).14 20.12,72.24 20.12,71.02 17.98,68.89 J2.10 17.68,68.58 17.68,64.92 M1.J1.10
D8
  Top 0.305: DIGITAL(D13-D6).13 17.68,72.24 17.68,71.32 15.24,68.89 J2.11 M1.J1.11
D9
  Top 0.305: DIGITAL(D13-D6).12 15.24,71.32 12.8,68.89 J2.12 12.8,68.58 12.8,64.92 M1.J1.12
D10
  Top 0.305: DIGITAL(D13-D6).11 12.5,72.24 12.5,71.02 10.06,68.58 J2.13 10.06,68.28 10.06,64.92 M1.J1.13
D11/MOSI
  Top 0.305: DIGITAL(D13-D6).10 10.06,72.24 10.06,71.32 7.62,68.89 J2.14 M1.J1.14
D12/MISO
  Top 0.305: DIGITAL(D13-D6).9 7.62,71.32 4.88,68.58 J2.15 5.18,68.28 5.18,64.92 M1.J1.15
D13/SCK
  Top 0.305: DIGITAL(D13-D6).8 4.88,72.24 4.88,71.02 3.66,69.8 3.66,50.9 4.88,49.68 M1.J2.15 5.18,49.38 5.18,45.72 J1.15
GND
  pour Bottom (isolate 0.305): -1.27,-1.27 -1.27,101.6 101.6,101.6 101.6,-1.27
  pour Top (isolate 0.305, rank 2): -2.54,-2.54 -2.54,102.87 102.87,102.87 102.87,-2.54
IR
  Bottom 0.305: JP5.2 35.36,96.32 35.36,92.96 25.6,83.21 24.38,83.21 23.77,82.6 10.06,82.6 7.62,80.16 DIGITAL(D13-D6).6
LEDS_RCLK
  Bottom 0.305: DIGITAL(D6-D0).4 33.22,79.86 38.1,74.98 41.45,74.98 49.68,66.75 49.68,59.74 48.46,58.52 U1.12
LEDS_SER
  Bottom 0.305: DIGITAL(D6-D0).3 35.66,79.86 39.93,75.59 41.76,75.59 50.29,67.06 50.29,55.17 48.46,53.34 U1.14
LEDS_SERCLK
  Bottom 0.305: DIGITAL(D6-D0).5 30.48,79.86 35.97,74.37 41.15,74.37 46.94,68.58 46.94,62.18 48.16,60.96 U1.11
MOTOR_P1
  Top 0.305: IC1.4 12.8,85.04 17.68,80.16 DIGITAL(D13-D6).2
MOTOR_P2
  Top 0.305: IC1.3 10.36,85.04 15.24,80.16 DIGITAL(D13-D6).3
MOTOR_P3
  Top 0.305: IC1.2 7.62,85.04 12.5,80.16 DIGITAL(D13-D6).4
MOTOR_P4
  Top 0.305: IC1.1 5.18,85.04 10.06,80.16 DIGITAL(D13-D6).5
N$1
  Top 0.305: D1.3 83.19,52.7 83.82,52.07 88.27,52.07 91.12,49.21 91.12,45.4 89.85,44.13 64.77,44.13 63.5,45.4 49.21,45.4 42.23,52.39 42.23,55.56 R5.2
N$2
  Bottom 0.305: D1.4 84.45,49.21 84.77,48.9 84.77,45.09 83.19,43.5 54.93,43.5 48.9,49.53 43.81,49.53 39.05,54.29 39.05,58.1 R3.2
N$3
  Bottom 0.305: D1.1 80.64,52.07 84.14,48.58 84.14,45.4 82.87,44.13 56.83,44.13 48.9,52.07 43.18,52.07 R4.2
N$4
  Top 0.305: IC1.16 5.18,92.96 5.18,96.62 5.49,96.93 MOTOR_OUT.1
N$5
  Top 0.305: IC1.9 JP6.2 22.86,96.62 21.03,98.45 19.81,98.45 18.9,97.54 14.33,97.54 14.02,97.23 MOTOR_OUT.5
N$6
  Top 0.305: LED8.A 75.29,63.09 67.67,63.09 67.36,63.4 R19.2
N$7
  Top 0.305: R18.2 75.59,60.96 76.81,59.74 77.72,59.74 81.08,63.09 81.08,64.62 82.3,65.84 LED7.A
N$8
  Top 0.305: R17.2 67.36,58.52 83.21,58.52 87.48,62.79 89.61,62.79 LED6.A
N$9
  Top 0.305: U1.4 56.08,56.08 59.44,56.08 R16.1
N$10
  Top 0.305: R16.2 67.36,56.08 70.71,56.08 72.06,57.43 91.31,57.43 92.66,56.08 LED5.A
N$11
  Top 0.305: R15.2 79.55,53.34 84.12,48.77 89.61,48.77 LED4.A
N$12
  Bottom 0.305: LED3.A 72.24,45.72 67.36,50.6 R14.2
N$13
  Top 0.305: R13.2 67.36,48.46 75.29,48.46 LED2.A
N$14
  Bottom 0.305: R12.2 67.36,65.84 72.24,60.96 72.24,56.08 LED1.A
N$15
  Bottom 0.305: JP5.1 38.1,94.16 26.54,82.6 24.69,82.6 24.08,81.99 19.81,81.99 18.9,81.08 18.9,78.33 14.02,73.46 14.02,57.91 6.4,50.29 6.4,38.1 U$2.1
N$17
  Top 0.305: R11.1 32.97,24.13 47.55,38.71 47.55,40.54 OS1.A
N$18
  Top 0.305: OS1.C 47.55,35.36 45.11,35.36 30.18,20.42 29.26,20.42 R8.1
  Bottom 0.305: JP5.3 32.92,96.32 28.96,96.32 19.51,86.87 7.01,86.87 6.4,86.26 6.4,83.82 2.44,79.86 2.44,19.51 14.02,7.92 16.76,7.92 18.29,6.4 18.29,5.79 19.2,4.88 22.25,4.88 28.96,11.58 28.96,20.12 R8.1
N$66
  Top 0.305: IC1.15 7.62,96.93 MOTOR_OUT.2
N$67
  Top 0.305: IC1.14 10.06,92.96 10.06,96.93 MOTOR_OUT.3
N$68
  Top 0.305: IC1.13 12.5,92.96 12.5,96.32 11.89,96.93 MOTOR_OUT.4
N$70
  Bottom 0.305: DIS1.P$11 70.1,96.93 70.1,87.17 60.96,78.03 60.96,74.02 64.24,70.74 U2.15
N$71
  Bottom 0.305: DIS1.P$7 79.86,96.93 79.86,94.18 68.58,82.91 68.58,78.94 67.36,77.72 U2.1
N$72
  Top 0.305: DIS1.P$4 74.68,81.69 71.93,78.94 66.14,78.94 64.92,77.72 U2.2
N$73
  Top 0.305: U2.3 64.31,79.55 67.06,79.55 69.19,81.69 69.8,81.69 DIS1.P$2
N$74
  Top 0.305: DIS1.P$1 67.06,81.69 63.7,81.69 59.74,77.72 U2.4
N$75
  Top 0.305: DIS1.P$10 72.24,96.93 72.24,96.32 57.3,81.38 57.3,77.72 U2.5
N$76
  Top 0.305: DIS1.P$5 77.42,81.69 71.93,76.2 56.08,76.2 54.86,77.42 U2.6
N$77
  Bottom 0.305: U2.7 53.34,76.2 57.71,76.2 60.96,72.95 60.96,69.19 61.57,68.58 67.97,68.58 72.24,72.85 72.24,81.69 DIS1.P$3
N$78
  Bottom 0.305: U2.9 49.68,69.8 50.29,69.8 52.73,67.36 89,67.36 91.44,69.8 U3.14
N$79
  Top 0.305: DIS1.P$8 77.72,96.93 77.72,93.88 93.88,77.72 U3.2
N$80  (via drill 0.35)
  Top 0.305: v78.94,95.1 96.32,77.72 U3.1
  Bottom 0.305: v78.94,95.1 76.81,95.1 74.98,96.93 DIS1.P$9
N$81  (via drill 0.35)
  Top 0.305: v69.19,92.05 69.8,92.05 78.64,83.21 78.64,79.25 77.42,78.03 77.42,76.81 82.91,71.32 92.66,71.32 93.88,70.1 U3.15
  Bottom 0.305: v69.19,92.05 67.36,93.88 67.36,96.93 DIS1.P$12
N$82
  Top 0.305: DIS1.P$6 80.16,81.69 87.48,81.69 91.44,77.72 U3.3
N$92
  Top 0.305: U1.15 48.46,50.9 48.46,51.51 52.02,55.07 52.02,65.48 53.9,67.36 58.22,67.36 59.44,66.14 R12.1
N$93
  Top 0.305: U1.1 56.08,48.46 59.44,48.46 R13.1
N$94
  Top 0.305: U1.2 56.08,50.9 59.44,50.9 R14.1
N$95
  Top 0.305: R15.1 U1.3
N$97
  Top 0.305: U1.5 56.08,58.52 59.44,58.52 R17.1
N$98
  Top 0.305: R18.1 U1.6
N$99
  Top 0.305: TRI3.A 50.9,28.96 50.9,26.52 52.12,25.3 52.12,12.5 51.21,11.58 S1.2
N$102
  Top 0.305: U1.7 56.08,63.7 59.44,63.7 R19.1
N$103
  Top 0.305: TRI4.A 50.6,18.9 44.5,12.8 16.76,12.8 15.54,11.58 S2.2
N$104
  Bottom 0.305: S3.2 33.17,13.79 41.43,22.05 48.56,22.05 50.6,24.08 TRI5.A
RGB_B
  Top 0.305: ANALOG(A7-A0).3 24.08,39.32 24.08,50.6 32.92,59.44 R3.1
RGB_G
  Bottom 0.305: ANALOG(A7-A0).2 15.24,35.66 19.2,39.62 19.2,42.06 20.73,43.59 21.03,43.59 21.64,44.2 21.64,50.29 28.35,57 32.92,57 R5.1
RGB_R
  Bottom 0.305: ANALOG(A7-A0).1 14.63,31.09 15.85,31.09 16.46,31.7 16.46,34.44 21.64,39.62 21.64,42.06 24.08,44.5 24.08,49.99 28.65,54.56 32.92,54.56 R4.1
RST.1
  Top 0.305: M1.J1.3 35.66,64.92 35.66,68.28 J2.3
RST.2
  Top 0.305: M1.J2.3 35.66,49.38 35.66,45.72 J1.3
SCL
  Top 0.305: ANALOG(A7-A0).6 17.98,25.6 3.96,25.6 U$1.3
SDA
  Top 0.305: ANALOG(A7-A0).5 22.86,32.92 17.98,28.04 17.78,28.04 3.96,28.04 U$1.4
TRIM1
  Bottom 0.305: ANALOG(A7-A0).7 28.04,33.22 31.7,36.88 40.54,36.88 41.76,38.1 TRI2.S
TRIM2
  Top 0.305: ANALOG(A7-A0).8 30.48,33.22 31.7,33.22 36.58,38.1 TRI1.S
VIN
  Top 0.305: M1.J2.1 40.54,49.38 40.54,45.72 J1.1

### Text on the board
tPlace: 12V | 5V | OS | IR | CURSO DE | ELETRÔNICA